# Altium schematic sheet Battery Charger.SchDoc (part 1 of 2)
size B; SheetNumber: 4; SheetTotal: 12
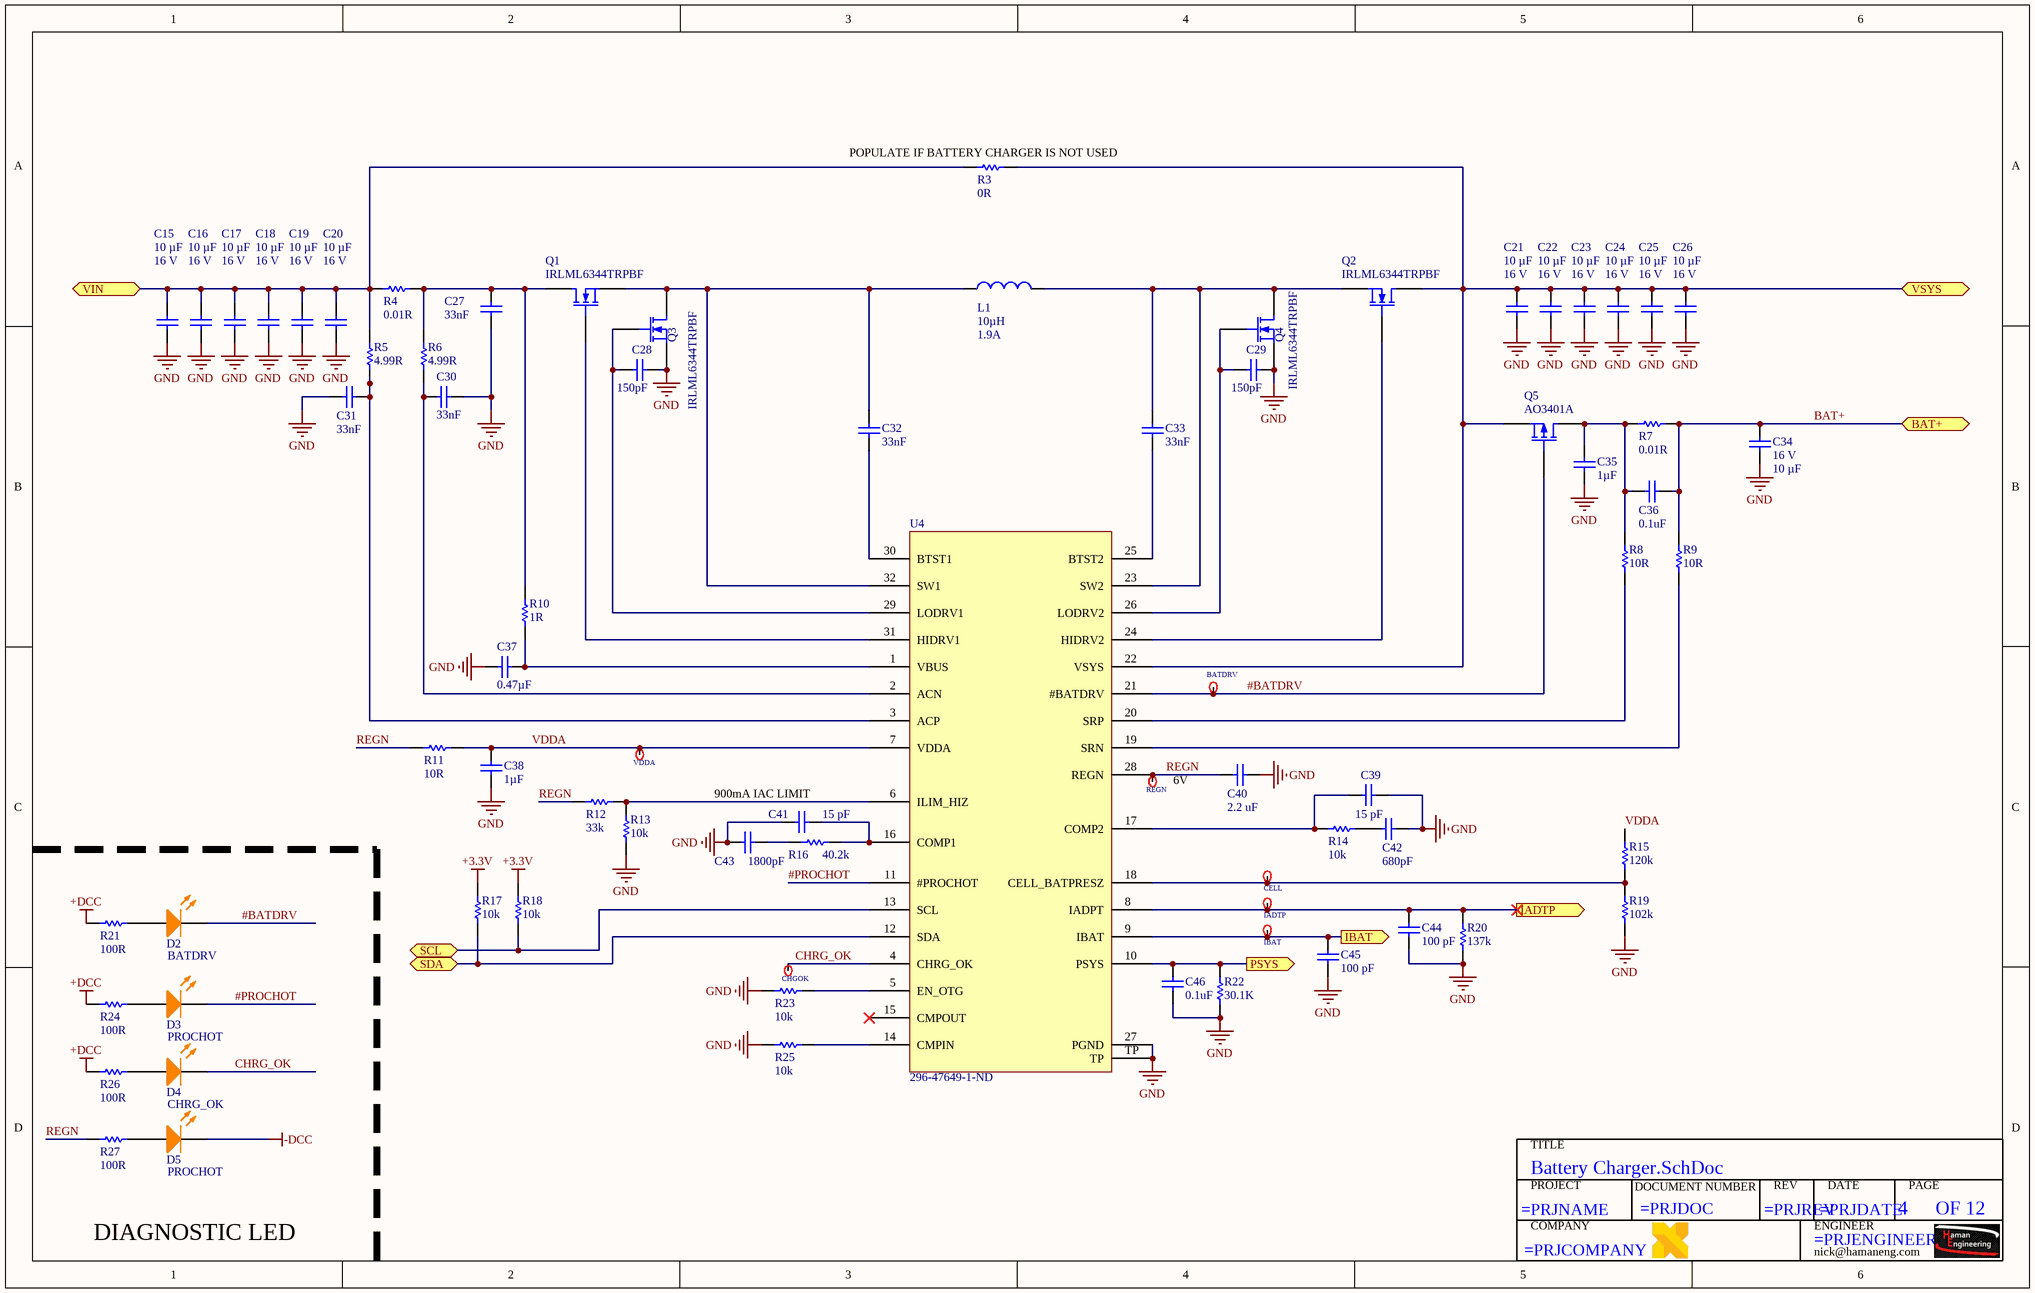
[diagram p0: Battery Charger.SchDoc]

## Parts
*?  TITLEBLOCK  (value not drawn)  (graphical)
BATDRV  5001  [KEYSTONE TP]  (value not drawn)  (no BOM)
C15  Nominal voltage: 16 V  Capacity (elec.): 10 µF  [1206C]  (hidden comment: 50V)
C16  Nominal voltage: 16 V  Capacity (elec.): 10 µF  [1206C]  (hidden comment: 50V)
C17  Nominal voltage: 16 V  Capacity (elec.): 10 µF  [1206C]  (hidden comment: 50V)
C18  Nominal voltage: 16 V  Capacity (elec.): 10 µF  [1206C]  (hidden comment: 50V)
C19  Nominal voltage: 16 V  Capacity (elec.): 10 µF  [1206C]  (hidden comment: 50V)
C20  Nominal voltage: 16 V  Capacity (elec.): 10 µF  [1206C]  (hidden comment: 50V)
C21  Nominal voltage: 16 V  Capacity (elec.): 10 µF  [1206C]  (hidden comment: 50V)
C22  Nominal voltage: 16 V  Capacity (elec.): 10 µF  [1206C]  (hidden comment: 50V)
C23  Nominal voltage: 16 V  Capacity (elec.): 10 µF  [1206C]  (hidden comment: 50V)
C24  Nominal voltage: 16 V  Capacity (elec.): 10 µF  [1206C]  (hidden comment: 50V)
C25  Nominal voltage: 16 V  Capacity (elec.): 10 µF  [1206C]  (hidden comment: 50V)
C26  Nominal voltage: 16 V  Capacity (elec.): 10 µF  [1206C]  (hidden comment: 50V)
C27  Capacitance Value: 33nF  [0402C]  (hidden comment: 50V)
C28  Capacitance: 150pF  [0402C]  (hidden comment: 50V)
C29  Capacitance: 150pF  [0402C]  (hidden comment: 50V)
C30  Capacitance Value: 33nF  [0402C]  (hidden comment: 50V)
C31  Capacitance Value: 33nF  [0402C]  (hidden comment: 50V)
C32  Capacitance Value: 33nF  [0402C]  (hidden comment: 50V)
C33  Capacitance Value: 33nF  [0402C]  (hidden comment: 50V)
C34  Nominal voltage: 16 V  Capacity (elec.): 10 µF  [1206C]  (hidden comment: 50V)
C35  Capacitance: 1µF  [0402C]  (hidden comment: 50V)
C36  Capacitance: 0.1uF  [0402C]  (hidden comment: 50V)
C37  Capacitance: 0.47µF  [0402C]  (hidden comment: 50V)
C38  Capacitance: 1µF  [0402C]  (hidden comment: 50V)
C39  Capacitance: 15 pF  [0402C]  (hidden comment: 50V)
C40  Capacitance Value: 2.2 uF  [0402C]  (hidden comment: 50V)
C41  Capacitance: 15 pF  [0402C]  (hidden comment: 50V)
C42  Capacitance: 680pF  [0402C]  (hidden comment: 50V)
C43  Capacitance: 1800pF  [0402C]  (hidden comment: 50V)
C44  Capacitance: 100 pF  [0402C]  (hidden comment: 50V)
C45  Capacitance: 100 pF  [0402C]  (hidden comment: 50V)
C46  Capacitance: 0.1uF  [0402C]  (hidden comment: 50V)
CELL  5001  [KEYSTONE TP]  (value not drawn)  (no BOM)
CHGOK  5001  [KEYSTONE TP]  (value not drawn)  (no BOM)
D2  BATDRV  [0402L-ORANGE]
D3  PROCHOT  [0402L-ORANGE]
D4  CHRG_OK  [0402L-ORANGE]
D5  PROCHOT  [0402L-ORANGE]
IADTP  5001  [KEYSTONE TP]  (value not drawn)  (no BOM)
IBAT  5001  [KEYSTONE TP]  (value not drawn)  (no BOM)
L1  Inductance: 10µH  Current - Saturation: 1.9A  [NR6028T100M]  (hidden comment: Inductor)
Q1  Manufacturer Part Number: IRLML6344TRPBF  [SOT-23]  (hidden comment: MOSFET-N)
Q2  Manufacturer Part Number: IRLML6344TRPBF  [SOT-23]  (hidden comment: MOSFET-N)
Q3  Manufacturer Part Number: IRLML6344TRPBF  [SOT-23]  (hidden comment: MOSFET-N)
Q4  Manufacturer Part Number: IRLML6344TRPBF  [SOT-23]  (hidden comment: MOSFET-N)
Q5  Manufacturer Part Number: AO3401A  [SOT-23]
R3  Resistance (Ohms): 0R  [0402R]  (hidden comment: Res 0805)
R4  Resistance (Ohms): 0.01R  [0402R]  (hidden comment: Res 0805)
R5  Resistance: 4.99R  [0402R]  (hidden comment: Res 0805)
R6  Resistance: 4.99R  [0402R]  (hidden comment: Res 0805)
R7  Resistance (Ohms): 0.01R  [0402R]  (hidden comment: Res 0805)
R8  Resistance: 10R  [0402R]  (hidden comment: Res 0805)
R9  Resistance: 10R  [0402R]  (hidden comment: Res 0805)
R10  Resistance: 1R  [0402R]  (hidden comment: Res 0805)
R11  Resistance: 10R  [0402R]  (hidden comment: Res 0805)
R12  Resistance Value: 33k  [0402R]  (hidden comment: Res 0805)
R13  Resistance: 10k  [0402R]  (hidden comment: Res 0805)
R14  Resistance: 10k  [0402R]  (hidden comment: Res 0805)
R15  Resistance: 120k  [0402R]  (hidden comment: Res 0805)
R16  Resistance: 40.2k  [0402R]  (hidden comment: Res 0805)
R17  Resistance: 10k  [0402R]  (hidden comment: Res 0805)
R18  Resistance: 10k  [0402R]  (hidden comment: Res 0805)
R19  Resistance: 102k  [0402R]  (hidden comment: Res 0805)
R20  Resistance (Ohms): 137k  [0402R]  (hidden comment: Res 0805)
R21  Resistance: 100R  [0402R]  (hidden comment: Res 0805)
R22  Resistance: 30.1K  [0402R]  (hidden comment: Res 0805)
R23  Resistance: 10k  [0402R]  (hidden comment: Res 0805)
R24  Resistance: 100R  [0402R]  (hidden comment: Res 0805)
R25  Resistance: 10k  [0402R]  (hidden comment: Res 0805)
R26  Resistance: 100R  [0402R]  (hidden comment: Res 0805)
R27  Resistance: 100R  [0402R]  (hidden comment: Res 0805)
REGN  5001  [KEYSTONE TP]  (value not drawn)  (no BOM)
U4  Supplier Part Number 1: 296-47649-1-ND  [WFQFN-32]  (hidden comment: BQ25703ARSNR)
VDDA  5001  [KEYSTONE TP]  (value not drawn)  (no BOM)

## Ports
BAT+, IADTP (out), IBAT (out), PSYS (out), SCL, SDA, VIN, VSYS

## Nets
+3.3V: R17.2 R18.2
+DCC: R21.1 R24.1 R26.1
-DCC: D5.2(K)
GND: C15.2 C16.2 C17.2 C18.2 C19.2 C20.2 C21.2 C22.2 C23.2 C24.2 C25.2 C26.2 C27.1 C28.2 C29.2 C30.2 C31.2 C34.2 C35.2 C37.1 C38.2 C39.2 C40.1 C41.1 C42.2 C43.1 C44.1 C45.1 C46.2 Q3.2(S) Q4.2(S) R13.1 R19.1 R20.1 R22.1 R23.1 R25.1 U4.27(PGND) U4.TP
#BATDRV: BATDRV.1 D2.2(K) Q5.1(G) U4.21(#BATDRV)
#PROCHOT: D3.2(K) U4.11(#PROCHOT)
BAT+: C34.1 C36.1 R7.2 R9.2 ; port BAT+
CHRG_OK: CHGOK.1 D4.2(K) U4.4(CHRG_OK)
IADTP: C44.2 IADTP.1 R20.2 U4.8(IADPT) ; port IADTP
IBAT: C45.2 IBAT.1 U4.9(IBAT) ; port IBAT
PSYS: C46.1 R22.2 U4.10(PSYS) ; port PSYS
REGN: C40.2 R11.1 R12.1 R27.1 REGN.1 U4.28(REGN)
SCL: R18.1 U4.13(SCL) ; port SCL
SDA: R17.1 U4.12(SDA) ; port SDA
VDDA: C38.1 R11.2 R15.2 U4.7(VDDA) VDDA.1
VIN: C15.1 C16.1 C17.1 C18.1 C19.1 C20.1 R3.1 R4.1 R5.2 ; port VIN
VSYS: C21.1 C22.1 C23.1 C24.1 C25.1 C26.1 Q2.3(D) Q5.2(S) R3.2 U4.22(VSYS) ; port VSYS
NetC27_2: C27.2 Q1.3(D) R4.2 R6.2 R10.2
NetC28_1: C28.1 Q3.1(G) U4.29(LODRV1)
NetC29_1: C29.1 Q4.1(G) U4.26(LODRV2)
NetC30_1: C30.1 R6.1 U4.2(ACN)
NetC31_1: C31.1 R5.1 U4.3(ACP)
NetC32_1: C32.1 U4.30(BTST1)
NetC32_2: C32.2 L1.1 Q1.2(S) Q3.3(D) U4.32(SW1)
NetC33_1: C33.1 U4.25(BTST2)
NetC33_2: C33.2 L1.2 Q2.2(S) Q4.3(D) U4.23(SW2)
NetC35_1: C35.1 C36.2 Q5.3(D) R7.1 R8.2
NetC37_2: C37.2 R10.1 U4.1(VBUS)
NetC39_1: C39.1 R14.1 U4.17(COMP2)
NetC41_2: C41.2 R16.2 U4.16(COMP1)
NetC42_1: C42.1 R14.2
NetC43_2: C43.2 R16.1
NetCELL_1: CELL.1 R15.1 R19.2 U4.18(CELL_BATPRESZ)
NetD2_1: D2.1(A) R21.2
NetD3_1: D3.1(A) R24.2
NetD4_1: D4.1(A) R26.2
NetD5_1: D5.1(A) R27.2
NetQ1_1: Q1.1(G) U4.31(HIDRV1)
NetQ2_1: Q2.1(G) U4.24(HIDRV2)
NetR8_1: R8.1 U4.20(SRP)
NetR9_1: R9.1 U4.19(SRN)
NetR12_2: R12.2 R13.2 U4.6(ILIM_HIZ)
NetR23_2: R23.2 U4.5(EN_OTG)
NetR25_2: R25.2 U4.14(CMPIN)

Not connected (* = marked no-connect by the designer): U4 15(CMPOUT)*

## Notes on the sheet
- (near R3) POPULATE IF BATTERY CHARGER IS NOT USED
- (near C41) 900mA IAC LIMIT
- (near REGN) 6V
- DIAGNOSTIC LED
- (in symbol TITLEBLOCK) TITLE; PROJECT; DOCUMENT NUMBER; REV; DATE; PAGE; OF; COMPANY; ENGINEER; nick@hamaneng.com